# Altium project CrystalTaming.PrjPcb
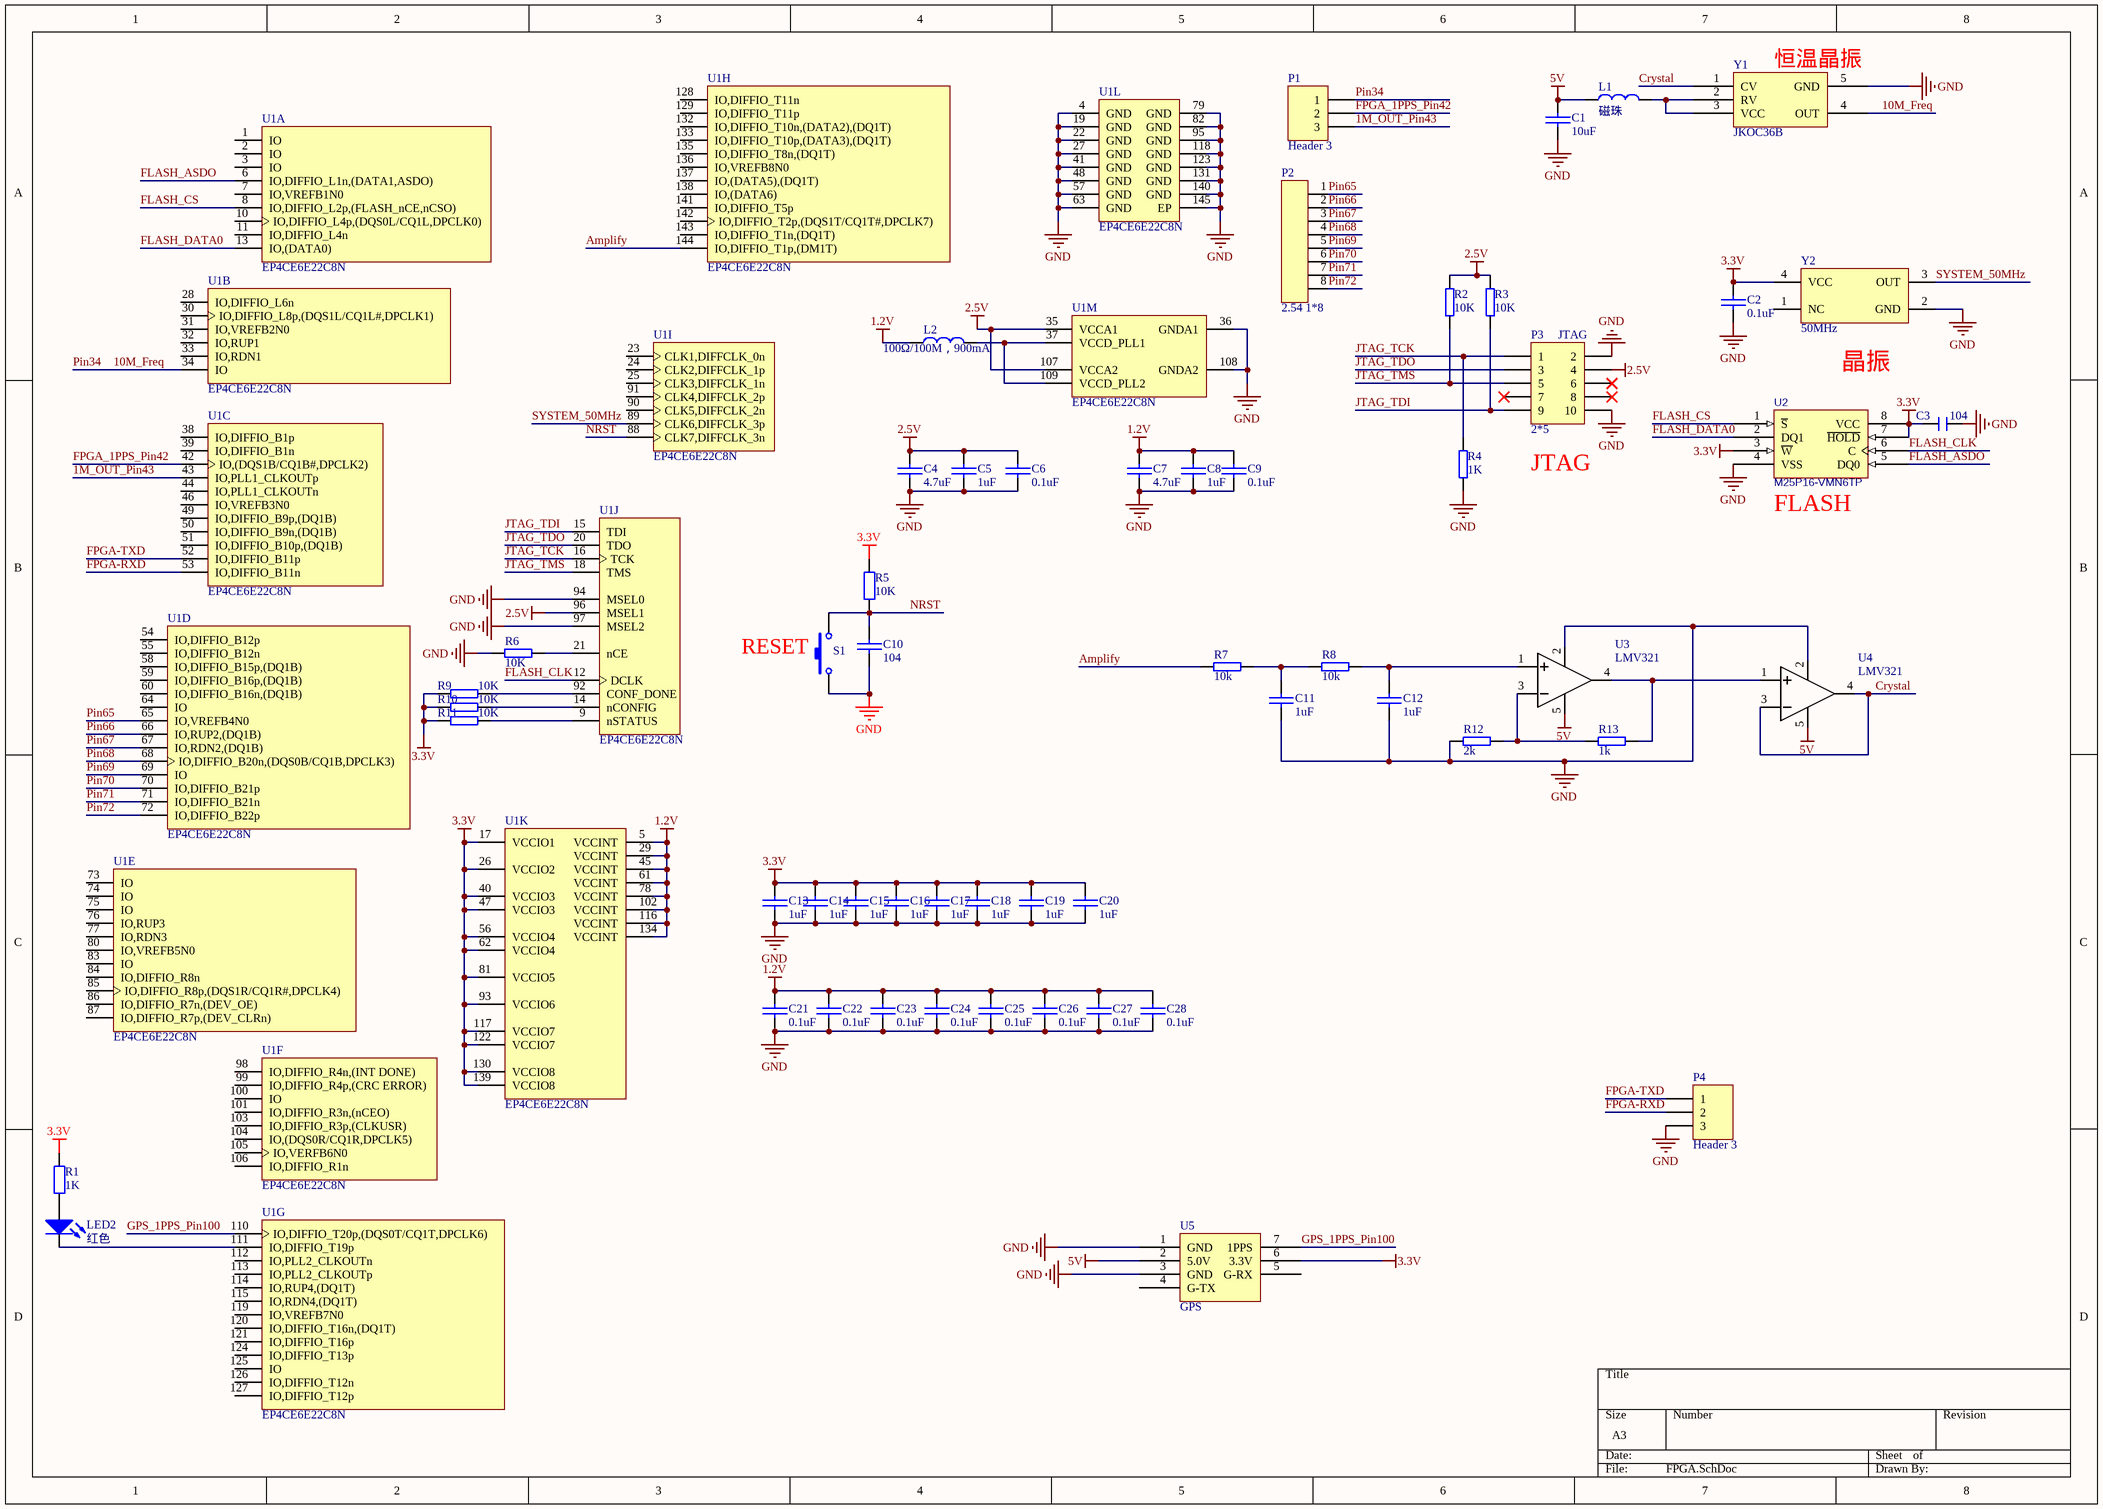
[diagram p0: FPGA.SchDoc]
4 sheets, 288 parts. Net scope: global (net labels, ports and power ports of the same name join across sheets).
Board files: GPSDO_V1.0.PcbDoc, GPSDO_V2.0.PcbDoc, GPSDO_V3.0.PcbDoc
Sheets:
  FPGA.SchDoc
  POWER.SchDoc
  GPSDO_V2.0.SchDoc
  GPSDO_V3.0.SchDoc

## Sheet FPGA.SchDoc
size A3; SheetNumber: 1; SheetTotal: 2

### Parts
(Parts that share a designator on the sheet are numbered #1, #2 ... from top to bottom, then left to right.)
C1#1  10uF  [0805]
C2#1  0.1uF  [0805]
C3#1  104  [0805]
C4#1  4.7uF  [0805]
C5#1  1uF  [0805]
C6#1  0.1uF  [0805]
C7#1  4.7uF  [0805]
C8#1  1uF  [0805]
C9#1  0.1uF  [0805]
C10#1  104  [0805]
C11#1  1uF  [0805]
C12#1  1uF  [0805]
C13#1  1uF  [0805]
C14#1  1uF  [0805]
C15#1  1uF  [0805]
C16  1uF  [0805]
C17  1uF  [0805]
C18#1  1uF  [0805]
C19#1  1uF  [0805]
C20#1  1uF  [0805]
C21#1  0.1uF  [0805]
C22#1  0.1uF  [0805]
C23#1  0.1uF  [0805]
C24#1  0.1uF  [0805]
C25#1  0.1uF  [0805]
C26#1  0.1uF  [0805]
C27#1  0.1uF  [0805]
C28#1  0.1uF  [0805]
L1#1  磁珠  [0805]
L2#1  100Ω/100M，900mA  [0805]
LED2#1  红色  [LED0805]
P1#1  Header 3  [HDR1X3]
P2#1  2.54 1*8  [单排插针 2.54 1*8]
P3#1  JTAG  封装: 2*5  [DC3压线座 2.54 2*5]
P4#1  Header 3  [HDR1X3]
R1#1  1K  [0805]
R2#1  10K  [0805]
R3#1  10K  [0805]
R4#1  1K  [0805]
R5#1  10K  [0805]
R6#1  10K  [0805]
R7#1  10k  [0805]
R8#1  10k  [0805]
R9#1  10K  [0805]
R10#1  10K  [0805]
R11#1  10K  [0805]
R12#1  2k  [0805]
R13#1  1k  [0805]
S1  key  [按键 轻触  6*3]  (value not drawn)
U1#1  EP4CE6E22C8N  [EP4CE6E22C8N]  (parts A,B,C,D,E,F,G,H,I,J,K,L,M of 13)
U2#1  M25P16-VMN6TP  [SOIC-8]
U3#1  LMV321  [SOT23-5]
U4#1  LMV321  [SOT23-5]
U5#1  GPS  [GPS]
Y1#1  JKOC36B  [恒温晶振 10M]
Y2#1  50MHz  [晶振 有源 5*7]

### Nets
1.2V: C7#1.2 C8#1.2 C9#1.2 C21#1.2 C22#1.2 C23#1.2 C24#1.2 C25#1.2 C26#1.2 C27#1.2 C28#1.2 L2#1.1 U1#1.5(VCCINT) U1#1.29(VCCINT) U1#1.45(VCCINT) U1#1.61(VCCINT) U1#1.78(VCCINT) U1#1.102(VCCINT) U1#1.116(VCCINT) U1#1.134(VCCINT)
2.5V: C4#1.2 C5#1.2 C6#1.2 P3#1.4 R2#1.1 R3#1.1 U1#1.35(VCCA1) U1#1.96(MSEL1) U1#1.107(VCCA2)
3.3V: C2#1.2 C3#1.2 C13#1.2 C14#1.2 C15#1.2 C16.2 C17.2 C18#1.2 C19#1.2 C20#1.2 R1#1.1 R5#1.1 R9#1.2 R10#1.2 R11#1.2 U1#1.17(VCCIO1) U1#1.26(VCCIO2) U1#1.40(VCCIO3) U1#1.47(VCCIO3) U1#1.56(VCCIO4) U1#1.62(VCCIO4) U1#1.81(VCCIO5) U1#1.93(VCCIO6) U1#1.117(VCCIO7) U1#1.122(VCCIO7) U1#1.130(VCCIO8) U1#1.139(VCCIO8) U2#1.3(~{W}) U2#1.7(~{HOLD}) U2#1.8(VCC) U5#1.6(3.3V) Y2#1.4(VCC)
5V: C1#1.1 L1#1.1 U3#1.5(VCC) U4#1.5(VCC) U5#1.2(5.0V)
GND: C1#1.2 C2#1.1 C3#1.1 C4#1.1 C5#1.1 C6#1.1 C7#1.1 C8#1.1 C9#1.1 C10#1.1 C11#1.1 C12#1.1 C13#1.1 C14#1.1 C15#1.1 C16.1 C17.1 C18#1.1 C19#1.1 C20#1.1 C21#1.1 C22#1.1 C23#1.1 C24#1.1 C25#1.1 C26#1.1 C27#1.1 C28#1.1 P3#1.2 P3#1.10 P4#1.3 R4#1.2 R6#1.2 R12#1.2 S1.1 U1#1.4(GND) U1#1.19(GND) U1#1.22(GND) U1#1.27(GND) U1#1.36(GNDA1) U1#1.41(GND) U1#1.48(GND) U1#1.57(GND) U1#1.63(GND) U1#1.79(GND) U1#1.82(GND) U1#1.94(MSEL0) U1#1.95(GND) U1#1.97(MSEL2) U1#1.108(GNDA2) U1#1.118(GND) U1#1.123(GND) U1#1.131(GND) U1#1.140(GND) U1#1.145(EP) U2#1.4(VSS) U3#1.2(GND) U4#1.2(GND) U5#1.1(GND) U5#1.3(GND) Y1#1.5(GND) Y2#1.2(GND)
1M_OUT_Pin43: P1#1.3 U1#1.43(IO,PLL1_CLKOUTp)
10M_Freq: P1#1.1 U1#1.34(IO) Y1#1.4(OUT)  [also labelled Pin34]
Amplify: R7#1.2 U1#1.144(IO,DIFFIO_T1p,(DM1T))
Crystal: U4#1.3(IN-) U4#1.4(OUT) Y1#1.1(CV)
FLASH_ASDO: U1#1.6(IO,DIFFIO_L1n,(DATA1,ASDO)) U2#1.5(DQ0)
FLASH_CLK: U1#1.12(DCLK) U2#1.6(C)
FLASH_CS: U1#1.8(IO,DIFFIO_L2p,(FLASH_nCE,nCSO)) U2#1.1(~{S})
FLASH_DATA0: U1#1.13(IO,(DATA0)) U2#1.2(DQ1)
FPGA-RXD: P4#1.2 U1#1.53(IO,DIFFIO_B11n)
FPGA-TXD: P4#1.1 U1#1.52(IO,DIFFIO_B11p)
FPGA_1PPS_Pin42: P1#1.2 U1#1.42(IO,(DQS1B/CQ1B#,DPCLK2))
GPS_1PPS_Pin100: U1#1.110(IO,DIFFIO_T20p,(DQS0T/CQ1T,DPCLK6)) U5#1.7(1PPS)
JTAG_TCK: P3#1.1 R4#1.1 U1#1.16(TCK)
JTAG_TDI: P3#1.9 R3#1.2 U1#1.15(TDI)
JTAG_TDO: P3#1.3 U1#1.20(TDO)
JTAG_TMS: P3#1.5 R2#1.2 U1#1.18(TMS)
NRST: C10#1.2 R5#1.2 S1.2 U1#1.88(CLK7,DIFFCLK_3n)
Pin65: P2#1.1 U1#1.65(IO,VREFB4N0)
Pin66: P2#1.2 U1#1.66(IO,RUP2,(DQ1B))
Pin67: P2#1.3 U1#1.67(IO,RDN2,(DQ1B))
Pin68: P2#1.4 U1#1.68(IO,DIFFIO_B20n,(DQS0B/CQ1B,DPCLK3))
Pin69: P2#1.5 U1#1.69(IO)
Pin70: P2#1.6 U1#1.70(IO,DIFFIO_B21p)
Pin71: P2#1.7 U1#1.71(IO,DIFFIO_B21n)
Pin72: P2#1.8 U1#1.72(IO,DIFFIO_B22p)
SYSTEM_50MHz: U1#1.89(CLK6,DIFFCLK_3p) Y2#1.3(OUT)
NetC11#1_2: C11#1.2 R7#1.1 R8#1.2
NetC12#1_2: C12#1.2 R8#1.1 U3#1.1(IN+)
NetL1#1_2: L1#1.2 Y1#1.2(RV) Y1#1.3(VCC)
NetL2#1_2: L2#1.2 U1#1.37(VCCD_PLL1) U1#1.109(VCCD_PLL2)
NetLED2#1_1: LED2#1.1(A) R1#1.2
NetLED2#1_2: LED2#1.2(K) U1#1.111(IO,DIFFIO_T19p)
NetR6#1_1: R6#1.1 U1#1.21(nCE)
NetR9#1_1: R9#1.1 U1#1.92(CONF_DONE)
NetR10#1_1: R10#1.1 U1#1.14(nCONFIG)
NetR11#1_1: R11#1.1 U1#1.9(nSTATUS)
NetR12#1_1: R12#1.1 R13#1.2 U3#1.3(IN-)
NetR13#1_1: R13#1.1 U3#1.4(OUT) U4#1.1(IN+)

Not connected (* = marked no-connect by the designer): P3#1 6* 7* 8*; U1#1 1(IO) 2(IO) 3(IO) 7(IO,VREFB1N0) 10(IO,DIFFIO_L4p,(DQS0L/CQ1L,DPCLK0)) 11(IO,DIFFIO_L4n) 23(CLK1,DIFFCLK_0n) 24(CLK2,DIFFCLK_1p) 25(CLK3,DIFFCLK_1n) 28(IO,DIFFIO_L6n) 30(IO,DIFFIO_L8p,(DQS1L/CQ1L#,DPCLK1)) 31(IO,VREFB2N0) 32(IO,RUP1) 33(IO,RDN1) 38(IO,DIFFIO_B1p) 39(IO,DIFFIO_B1n) 44(IO,PLL1_CLKOUTn) 46(IO,VREFB3N0) 49(IO,DIFFIO_B9p,(DQ1B)) 50(IO,DIFFIO_B9n,(DQ1B)) 51(IO,DIFFIO_B10p,(DQ1B)) 54(IO,DIFFIO_B12p) 55(IO,DIFFIO_B12n) 58(IO,DIFFIO_B15p,(DQ1B)) 59(IO,DIFFIO_B16p,(DQ1B)) 60(IO,DIFFIO_B16n,(DQ1B)) 64(IO) 73(IO) 74(IO) 75(IO) 76(IO,RUP3) 77(IO,RDN3) 80(IO,VREFB5N0) 83(IO) 84(IO,DIFFIO_R8n) 85(IO,DIFFIO_R8p,(DQS1R/CQ1R#,DPCLK4)) 86(IO,DIFFIO_R7n,(DEV_OE)) 87(IO,DIFFIO_R7p,(DEV_CLRn)) 90(CLK5,DIFFCLK_2n) 91(CLK4,DIFFCLK_2p) 98(IO,DIFFIO_R4n,(INT_DONE)) 99(IO,DIFFIO_R4p,(CRC_ERROR)) 100(IO) 101(IO,DIFFIO_R3n,(nCEO)) 103(IO,DIFFIO_R3p,(CLKUSR)) 104(IO,(DQS0R/CQ1R,DPCLK5)) 105(IO,VERFB6N0) 106(IO,DIFFIO_R1n) 112(IO,PLL2_CLKOUTn) 113(IO,PLL2_CLKOUTp) 114(IO,RUP4,(DQ1T)) 115(IO,RDN4,(DQ1T)) 119(IO,VREFB7N0) 120(IO,DIFFIO_T16n,(DQ1T)) 121(IO,DIFFIO_T16p) 124(IO,DIFFIO_T13p) 125(IO) 126(IO,DIFFIO_T12n) 127(IO,DIFFIO_T12p) 128(IO,DIFFIO_T11n) 129(IO,DIFFIO_T11p) 132(IO,DIFFIO_T10n,(DATA2),(DQ1T)) 133(IO,DIFFIO_T10p,(DATA3),(DQ1T)) 135(IO,DIFFIO_T8n,(DQ1T)) 136(IO,VREFB8N0) 137(IO,(DATA5),(DQ1T)) 138(IO,(DATA6)) 141(IO,DIFFIO_T5p) 142(IO,DIFFIO_T2p,(DQS1T/CQ1T#,DPCLK7)) 143(IO,DIFFIO_T1n,(DQ1T)); U5#1 4(G-TX) 5(G-RX); Y2#1 1(NC)

### Notes on the sheet
- (near Y1#1) 恒温晶振
- 晶振
- (near P3#1) JTAG
- (near U2#1) FLASH
- (near S1) RESET

### Library data of the parts
C1#1 C2#1 C4#1 C5#1 C6#1 C7#1 C8#1 C9#1 C11#1 C12#1 C13#1 C14#1 C15#1 C16 C17 C18#1 C19#1 C20#1 C21#1 C22#1 C23#1 C24#1 C25#1 C26#1 C27#1 C28#1 = 电容 贴片 0805: 名称: 贴片电容; 单位: 个; 封装: 0805
C3#1 = C: 无极性贴片电容; 版权归属: 源创客; 材质: X7R; BOM名称: 无极性贴片电容; 学习资源: www.ooocke.com
C10#1 = 贴片电容 0805: 名称: 贴片电容; 封装: 0603; 单位: 个
L1#1 L2#1 = 磁珠: 单位: 个; 名称: 磁珠; 封装: 0805
LED2#1 = 二极管 贴片发光 0805: 名称: 贴片发光二极管; 封装: 0805; 单位: 个
P1#1 P4#1 = Header 3: Header, 3-Pin; LatestRevisionDate: 17-Jul-2002; LatestRevisionNote: Re-released for DXP Platform.; Publisher: Altium Limited
P2#1 = 联结件 单排插针 2.54 1*8: 单位: 片; 封装: DIP; 名称: 单排插针
P3#1 = 联结件 DC3 2*5: 名称: 联结件; 单位: 个
R1#1 = 贴片电阻 0805: 名称: 贴片电阻; 单位: 个; 封装: 0805
R2#1 R3#1 R4#1 R6#1 R7#1 R8#1 R9#1 R10#1 R11#1 R12#1 R13#1 = 电阻 贴片 0805: 名称: 贴片电阻; 单位: 个; 封装: 0805
R5#1 = 贴片电阻 0603: 名称: 贴片电阻; 封装: 0603; 单位: 个
S1 = 按键 轻触 3*6: 单位: 个; 名称: 开关; 封装: 直插 12*12*12
U1#1 = 贴片芯片 EP4CE6E22C8N
U2#1 = M25P16-VMN6TP: BOM_Manufacturer: micron(镁光); Contributor: LCSC; BOM_Supplier: LCSC; BOM_Manufacturer Part: M25P16-VMN6TP; BOM_Supplier Part: C151067; BOM_JLCPCB Part Class: Extended Part; spicePre: U; spiceSymbolName: M25P16-VMN6TP
U3#1 U4#1 = 贴片芯片 LMV321: 单位: 个; 名称: 芯片; 封装: SOT23-5
Y1#1 = 恒温晶振 10M
Y2#1 = 晶振 有源: 名称: 晶振; 封装: 贴片; 单位: 个

## Sheet POWER.SchDoc
size A4; SheetNumber: 2; SheetTotal: 2
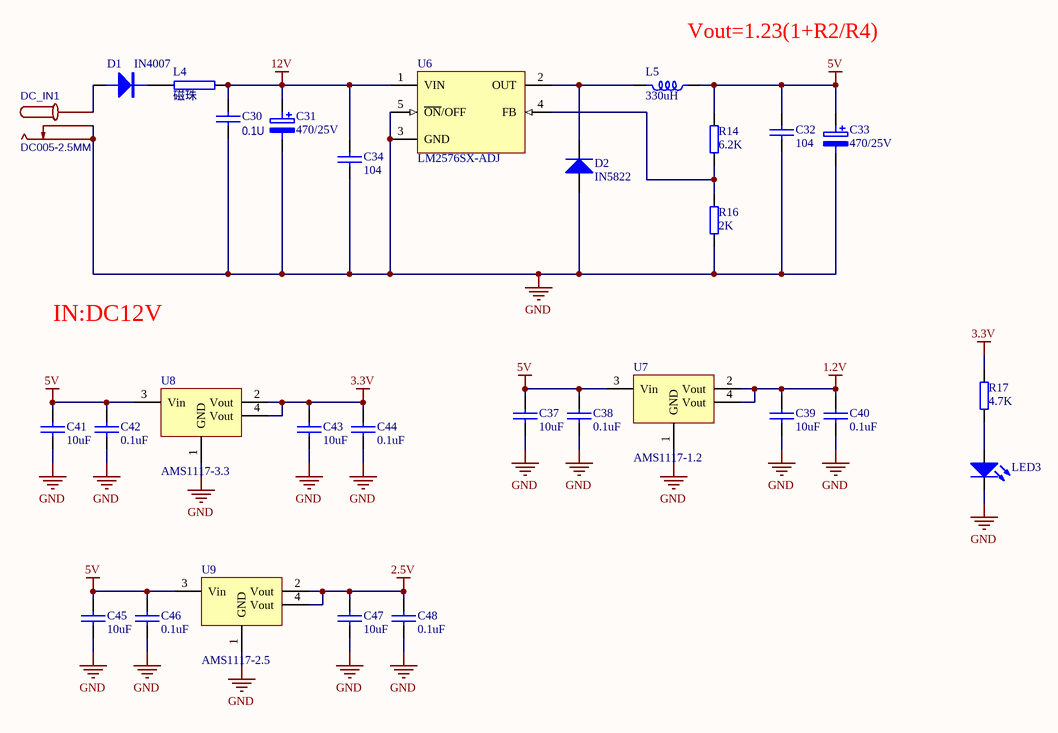
[diagram p1: POWER.SchDoc]

### Parts
(Parts that share a designator on the sheet are numbered #1, #2 ... from top to bottom, then left to right.)
C30#1  0.1U  [0805]
C31#1  470/25V  [电容 铝电解 470U/35V]
C32#1  104  [0805]
C33#1  470/25V  [电容 铝电解 470U/35V]
C34#1  104  [0805]
C37  10uF  [0805]
C38  0.1uF  [0805]
C39  10uF  [0805]
C40  0.1uF  [0805]
C41  10uF  [0805]
C42  0.1uF  [0805]
C43  10uF  [0805]
C44  0.1uF  [0805]
C45  10uF  [0805]
C46  0.1uF  [0805]
C47  10uF  [0805]
C48  0.1uF  [0805]
D1#1  IN4007  [二极管 贴片 4007]
D2#1  IN5822  [二极管 贴片 4007]
DC_IN1  DC005-2.5MM  [DC005-2.5MM]
L4  磁珠  [0805]
L5#1  330uH  [电感 贴片 12*12]
LED3#1  (no value)  [LED0805]
R14#1  6.2K  [0805]
R16#1  2K  [0805]
R17#1  4.7K  [0805]
U6#1  LM2576SX-ADJ  [TO263 LM2576]
U7#1  AMS1117-1.2  [SOT223]
U8#1  AMS1117-3.3  [SOT223]
U9#1  AMS1117-2.5  [SOT223]

### Nets
1.2V: C39.2 C40.2 U7#1.2(Vout) U7#1.4(Vout)
2.5V: C47.2 C48.2 U9#1.2(Vout) U9#1.4(Vout)
3.3V: C43.2 C44.2 R17#1.1 U8#1.2(Vout) U8#1.4(Vout)
5V: C32#1.2 C33#1.1 C37.2 C38.2 C41.2 C42.2 C45.2 C46.2 L5#1.2 R14#1.1 U7#1.3(Vin) U8#1.3(Vin) U9#1.3(Vin)
12V: C30#1.2 C31#1.1 C34#1.2 L4.1 U6#1.1(VIN)
GND: C30#1.1 C31#1.2 C32#1.1 C33#1.2 C34#1.1 C37.1 C38.1 C39.1 C40.1 C41.1 C42.1 C43.1 C44.1 C45.1 C46.1 C47.1 C48.1 D2#1.1(A) DC_IN1.2 DC_IN1.3 LED3#1.2(K) R16#1.2 U6#1.3(GND) U6#1.5(~{ON}/OFF) U7#1.1(GND) U8#1.1(GND) U9#1.1(GND)
NetD1#1_1: D1#1.1 DC_IN1.1
NetD1#1_2: D1#1.2 L4.2
NetD2#1_2: D2#1.2(K) L5#1.1 U6#1.2(OUT)
NetLED3#1_1: LED3#1.1(A) R17#1.2
NetR14#1_2: R14#1.2 R16#1.1 U6#1.4(FB)

### Notes on the sheet
- (near L5#1) Vout=1.23(1+R2/R4)
- IN:DC12V

### Library data of the parts
C30#1 = CAP
C31#1 C33#1 = 电容 贴片 铝电解 470u/25V: 名称: 贴片铝电解电容; 封装: 贴片; 单位: 个
C32#1 C34#1 C37-C48 = 电容 贴片 0805: 名称: 贴片电容; 单位: 个; 封装: 0805
D1#1 = DIODE
D2#1 = 二极管 贴片4007: 名称: 贴片二极管; 封装: 贴片; 单位: 个
DC_IN1 = DC005-2.5MM: BOM_Manufacturer: SOFNG(硕方); BOM_Manufacturer Part: DC005-T25; BOM_Supplier: LCSC; BOM_Supplier Part: C111573; BOM_JLCPCB Part Class: Extended Part; spicePre: D; spiceSymbolName: DC005-2.5MM
L4 = RES2
L5#1 = 电感 贴片 0805: 名称: 贴片电感; 封装: 0805; 单位: 个
LED3#1 = 二极管 贴片发光 0805: 名称: 贴片发光二极管; 封装: 0805; 单位: 个
R14#1 R16#1 R17#1 = 电阻 贴片 0805: 名称: 贴片电阻; 单位: 个; 封装: 0805
U6#1 = LM2576SX-5.0: DC-DC芯片; ComponentLink1Description: 供应商链接; ComponentLink1URL: http://www.szlcsc.com/product/details_35434.html; Package: TO-263-5; Supplier: LC; SuppliersPartNumber: C34465
U7#1 U8#1 U9#1 = 贴片芯片 SPX1117M3-3.3: LDO; 名称: 贴片芯片; 单位: 个; 封装: SOT223

## Sheet GPSDO_V2.0.SchDoc
size 457 x 330 mm
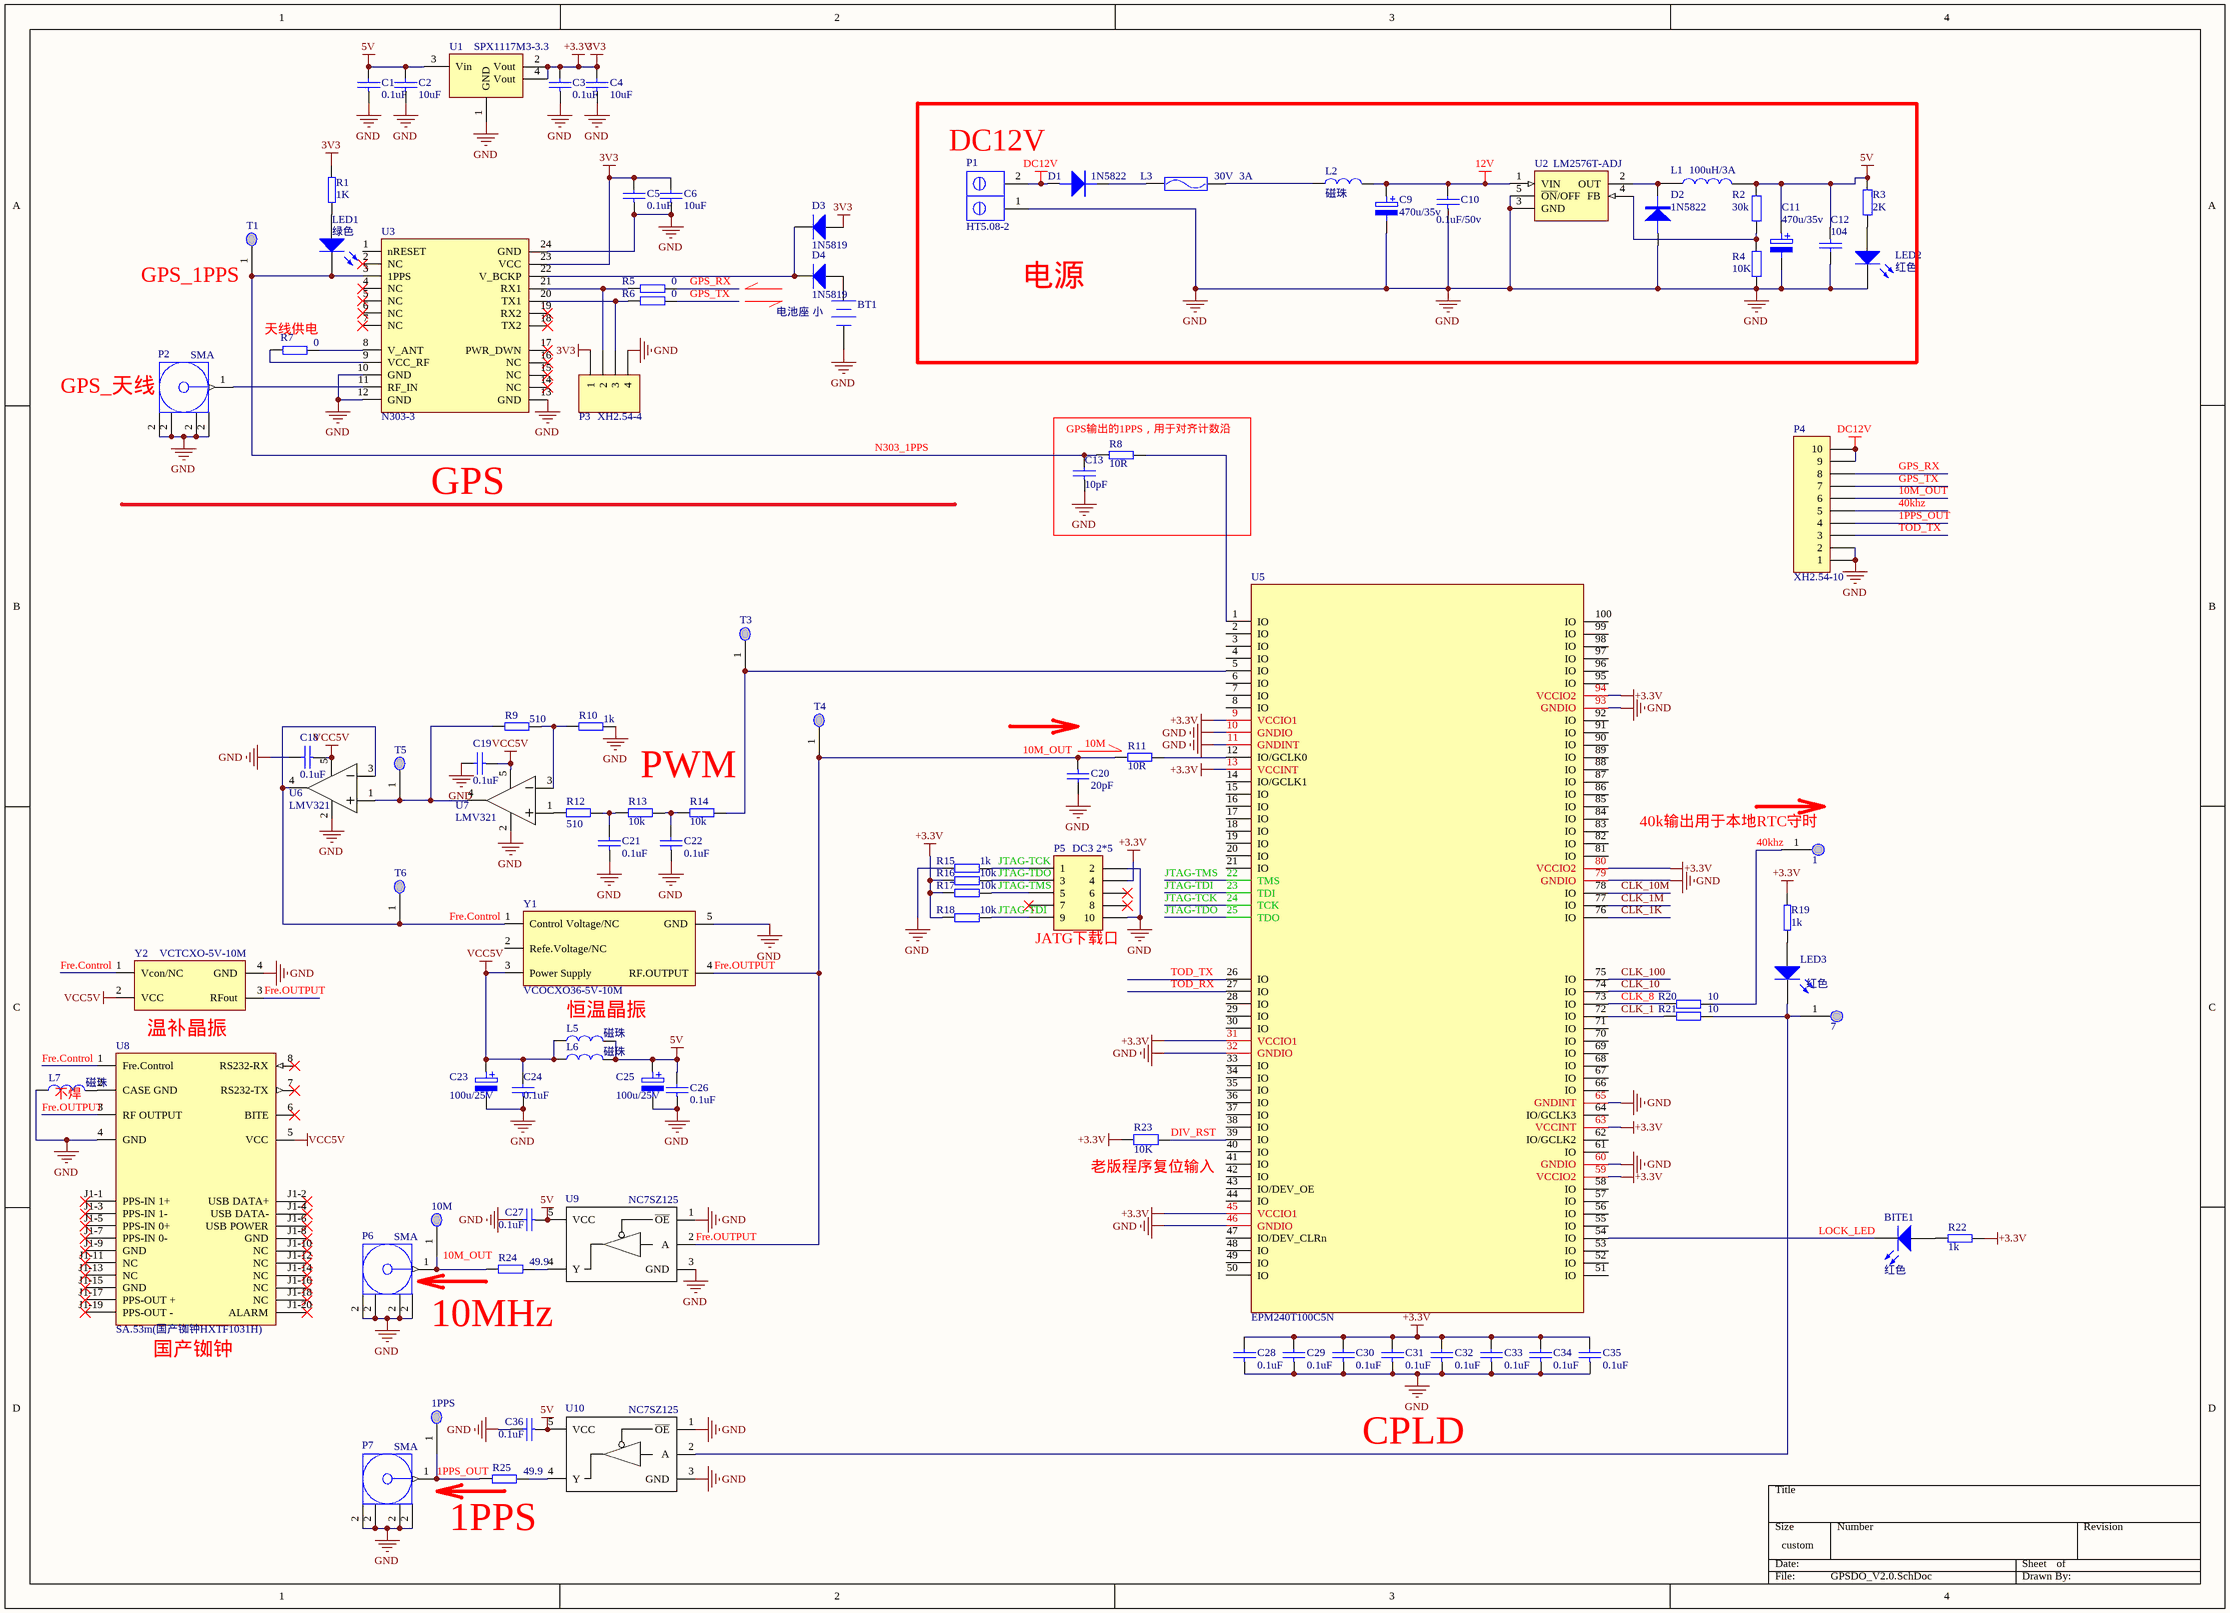
[diagram p2: GPSDO_V2.0.SchDoc]

### Parts
(Parts that share a designator on the sheet are numbered #1, #2 ... from top to bottom, then left to right.)
1#1  TEST  [测试点（圆形）]  (value not drawn)
1PPS#1  TEST  [测试点（圆形）]  (value not drawn)
7#1  TEST  [测试点（圆形）]  (value not drawn)
10M#1  TEST  [测试点（圆形）]  (value not drawn)
BITE1#1  红色  [LED0805]
BT1#1  电池座 小  [电池座 2032  直插]
C1#2  0.1uF  [0805]
C2#2  10uF  [1206]
C3#2  0.1uF  [0805]
C4#2  10uF  [1206]
C5#2  0.1uF  [0805]
C6#2  10uF  [1206]
C9#2  470u/35v  [电容 铝电解 470U/35V]
C10#2  0.1uF/50v  [0805]
C11#2  470u/35v  [电容 铝电解 470U/35V]
C12#2  104  [0805]
C13#2  10pF  [0805]
C18#2  0.1uF  [0805]
C19#2  0.1uF  [0805]
C20#2  20pF  [0805]
C21#2  0.1uF  [0805]
C22#2  0.1uF  [0805]
C23#2  100u/25V  [1206]
C24#2  0.1uF  [0805]
C25#2  100u/25V  [1206]
C26#2  0.1uF  [0805]
C27#2  0.1uF  [0805]
C28#2  0.1uF  [0805]
C29#1  0.1uF  [0805]
C30#2  0.1uF  [0805]
C31#2  0.1uF  [0805]
C32#2  0.1uF  [0805]
C33#2  0.1uF  [0805]
C34#2  0.1uF  [0805]
C35#1  0.1uF  [0805]
C36#1  0.1uF  [0805]
D1#2  1N5822  [二极管 贴片 4007]
D2#2  1N5822  [二极管 贴片 4007]
D3#1  1N5819  [二极管 贴片 IN4148]
D4#1  1N5819  [二极管 贴片 IN4148]
L1#2  100uH/3A  [电感 贴片 12*12]
L2#2  磁珠  [磁珠 直插]
L3#1  30V  3A  [30V/4A 自恢复保险]
L5#2  磁珠  [0805]
L6#1  磁珠  [0805]
L7#1  磁珠  [0805]
LED1#1  绿色  [LED0805]
LED2#2  红色  [Led0805]
LED3#2  红色  [LED0805]
P1#2  HT5.08-2  [KF128L-5.08-2P]
P2#2  SMA  [天线座 50ohm 直立]
P3#2  XH2.54-4  [VH2.54_4]
P4#2  XH2.54-10  [VH2.54_10]
P5#1  封装: DC3 2*5  [双排插针 2.54 2*5]  (hidden comment: DC3压线座)
P6#1  SMA  [天线座 50ohm 直立]
P7#1  SMA  [天线座 50ohm 直立]
R1#2  1K  [0805]
R2#2  30k  [0805]
R3#2  2K  [0805]
R4#2  10K  [0805]
R5#2  0  [0805]
R6#2  0  [0805]
R7#2  0  [0805]
R8#2  10R  [0805]
R9#2  510  [0805]
R10#2  1k  [0805]
R11#2  10R  [0805]
R12#2  510  [0805]
R13#2  10k  [0805]
R14#2  10k  [0805]
R15#1  1k  [0805]
R16#2  10k  [0805]
R17#2  10k  [0805]
R18#1  10k  [0805]
R19#1  1k  [0805]
R20#1  10  [0805]
R21#1  10  [0805]
R22#1  1k  [0805]
R23#1  10K  [0805]
R24#1  49.9  [0805]
R25#1  49.9  [0805]
T1#1  TEST  [测试点（圆形）]  (value not drawn)
T3#1  TEST  [测试点（圆形）]  (value not drawn)
T4#1  TEST  [测试点（圆形）]  (value not drawn)
T5#1  TEST  [测试点（圆形）]  (value not drawn)
T6#1  TEST  [测试点（圆形）]  (value not drawn)
U1#2  SPX1117M3-3.3  [SOT223]
U2#2  LM2576T-ADJ  [TO220 LM2576-YA30]
U3#2  N303-3  [模块 N303-3]
U5#2  EPM240T100C5N  [TQFP100]
U6#2  LMV321  [SOT23-5]
U7#2  LMV321  [SOT23-5]
U8#2  SA.53m(国产铷钟HXTF1031H)  [模块 SA.53m]
U9#2  NC7SZ125  [SOT23-5]
U10#1  NC7SZ125  [SOT23-5]
Y1#2  VCOCXO36-5V-10M  [模块 VCOCXO36-12V-10M]
Y2#2  VCTCXO-5V-10M  [模块 VCTCXO-5V-10M]

### Blocks framed on the sheet
GPS输出的1PPS，用于对齐计数沿: C13#2 R8#2

### Nets
5V: C1#2.2 C2#2.2 C11#2.1 C12#2.1 C25#2.1 C26#2.2 C27#2.1 C36#1.1 L1#2.2 L5#2.2 L6#1.2 R2#2.2 R3#2.1 U1#2.3(Vin) U9#2.5(VCC) U10#1.5(VCC)
12V: C9#2.1 C10#2.2 L2#2.2 U2#2.1(VIN)
+3.3V: C3#2.2 C4#2.2 C5#2.2 C6#2.2 C28#2.2 C29#1.2 C30#2.2 C31#2.2 C32#2.2 C33#2.2 C34#2.2 C35#1.2 D3#1.1(A) P3#2.1 P5#1.4 R1#2.1 R16#2.2 R17#2.2 R18#1.2 R19#1.1 R22#1.2 R23#1.2 U1#2.2(Vout) U1#2.4(Vout) U3#2.23(VCC) U5#2.9(VCCIO1) U5#2.13(VCCINT) U5#2.31(VCCIO1) U5#2.45(VCCIO1) U5#2.59(VCCIO2) U5#2.63(VCCINT) U5#2.80(VCCIO2) U5#2.94(VCCIO2)  [also labelled 3V3]
DC12V: D1#2.1(A) P1#2.2 P4#2.9 P4#2.10
GND: BT1#1.2(-) C1#2.1 C2#2.1 C3#2.1 C4#2.1 C5#2.1 C6#2.1 C9#2.2 C10#2.1 C11#2.2 C12#2.2 C13#2.1 C18#2.2 C19#2.2 C20#2.2 C21#2.1 C22#2.1 C23#2.2 C24#2.1 C25#2.2 C26#2.1 C27#2.2 C28#2.1 C29#1.1 C30#2.1 C31#2.1 C32#2.1 C33#2.1 C34#2.1 C35#1.1 C36#1.2 D2#2.1(A) L7#1.1 LED2#2.2(K) P1#2.1 P2#2.2 P3#2.4 P4#2.1 P4#2.2 P5#1.2 P5#1.10 P6#1.2 P7#1.2 R4#2.1 R10#2.1 R15#1.1 U1#2.1(GND) U2#2.3(GND) U2#2.5(~{ON}/OFF) U3#2.10(GND) U3#2.12(GND) U3#2.13(GND) U3#2.24(GND) U5#2.10(GNDIO) U5#2.11(GNDINT) U5#2.32(GNDIO) U5#2.46(GNDIO) U5#2.60(GNDIO) U5#2.65(GNDINT) U5#2.79(GNDIO) U5#2.93(GNDIO) U6#2.2(GND) U7#2.2(GND) U8#2.4(GND) U9#2.1(~{OE}) U9#2.3(GND) U10#1.1(~{OE}) U10#1.3(GND) Y1#2.5(GND) Y2#2.4(GND)
VCC5V: C18#2.1 C19#2.1 C23#2.1 C24#2.2 L5#2.1 L6#1.1 U6#2.5(VCC) U7#2.5(VCC) U8#2.5(VCC) Y1#2.3(Power_Supply) Y2#2.2(VCC)
1PPS_OUT: 1PPS#1.1 P4#2.4 P7#1.1(Signal) R25#1.2
10M_OUT: C20#2.1 P4#2.6 R11#2.2 T4#1.1 U8#2.3(RF_OUTPUT) U9#2.2(A) Y1#2.4(RF.OUTPUT) Y2#2.3(RFout)  [also labelled Fre.OUTPUT]
40khz: 1#1.1 P4#2.5 R20#1.1
CLK_1: R21#1.2 U5#2.72(IO)
CLK_1K: U5#2.76(IO)
CLK_1M: U5#2.77(IO)
CLK_8: R20#1.2 U5#2.73(IO)
CLK_10: U5#2.74(IO)
CLK_10M: U5#2.78(IO)
CLK_100: U5#2.75(IO)
DIV_RST: R23#1.1 U5#2.39(IO)
Fre.Control: T6#1.1 U6#2.3(IN-) U6#2.4(OUT) U8#2.1(Fre.Control) Y1#2.1(Control_Voltage/NC) Y2#2.1(Vcon/NC)
GPS_RX: P4#2.8 R5#2.1
GPS_TX: P4#2.7 R6#2.1
JTAG-TCK: P5#1.1 R15#1.2 U5#2.24(TCK)
JTAG-TDI: P5#1.9 R18#1.1 U5#2.23(TDI)
JTAG-TDO: P5#1.3 R16#2.1 U5#2.25(TDO)
JTAG-TMS: P5#1.5 R17#2.1 U5#2.22(TMS)
LOCK_LED: BITE1#1.2(K) U5#2.54(IO)
N303_1PPS: C13#2.2 LED1#1.2(K) R8#2.2 T1#1.1 U3#2.3(1PPS)
TOD_RX: U5#2.27(IO)
TOD_TX: P4#2.3 U5#2.26(IO)
Net7#1_1: 7#1.1 LED3#2.2(K) R21#1.1 U10#1.2(A)
Net10M#1_1: 10M#1.1 P6#1.1(Signal) R24#1.2
NetBITE1#1_1: BITE1#1.1(A) R22#1.1
NetBT1#1_1: BT1#1.1(+) D4#1.1(A)
NetC21#2_2: C21#2.2 R12#2.1 R13#2.2
NetC22#2_2: C22#2.2 R13#2.1 R14#2.2
NetD1#2_2: D1#2.2(K) L3#1.1
NetD2#2_2: D2#2.2(K) L1#2.1 U2#2.2(OUT)
NetD3#1_2: D3#1.2(K) D4#1.2(K) U3#2.22(V_BCKP)
NetL2#2_1: L2#2.1 L3#1.2
NetL7#1_2: L7#1.2 U8#2.2(CASE_GND)
NetLED1#1_1: LED1#1.1(A) R1#2.2
NetLED2#2_1: LED2#2.1(A) R3#2.2
NetLED3#2_1: LED3#2.1(A) R19#1.2
NetP2#2_1: P2#2.1(Signal) U3#2.11(RF_IN)
NetP3#2_2: P3#2.2 R5#2.2 U3#2.21(RX1)
NetP3#2_3: P3#2.3 R6#2.2 U3#2.20(TX1)
NetR2#2_1: R2#2.1 R4#2.2 U2#2.4(FB)
NetR7#2_1: R7#2.1 U3#2.8(V_ANT)
NetR7#2_2: R7#2.2 U3#2.9(VCC_RF)
NetR8#2_1: R8#2.1 U5#2.1(IO)
NetR9#2_1: R9#2.1 R10#2.2 U7#2.3(IN-)
NetR9#2_2: R9#2.2 T5#1.1 U6#2.1(IN+) U7#2.4(OUT)
NetR11#2_1: R11#2.1 U5#2.12(IO/GCLK0)
NetR12#2_2: R12#2.2 U7#2.1(IN+)
NetR14#2_1: R14#2.1 T3#1.1 U5#2.5(IO)
NetR24#1_1: R24#1.1 U9#2.4(Y)
NetR25#1_1: R25#1.1 U10#1.4(Y)

Not connected (* = marked no-connect by the designer): P5#1 6* 7* 8*; U3#2 1(nRESET) 2(NC)* 4(NC)* 5(NC)* 6(NC)* 7(NC)* 14(NC)* 15(NC)* 16(NC)* 17(PWR_DWN)* 18(TX2)* 19(RX2)*; U5#2 2(IO) 3(IO) 4(IO) 6(IO) 7(IO) 8(IO) 14(IO/GCLK1) 15(IO) 16(IO) 17(IO) 18(IO) 19(IO) 20(IO) 21(IO) 28(IO) 29(IO) 30(IO) 33(IO) 34(IO) 35(IO) 36(IO) 37(IO) 38(IO) 40(IO) 41(IO) 42(IO) 43(IO/DEV_OE) 44(IO) 47(IO/DEV_CLRn) 48(IO) 49(IO) 50(IO) 51(IO) 52(IO) 53(IO) 55(IO) 56(IO) 57(IO) 58(IO) 61(IO) 62(IO/GCLK2) 64(IO/GCLK3) 66(IO) 67(IO) 68(IO) 69(IO) 70(IO) 71(IO) 81(IO) 82(IO) 83(IO) 84(IO) 85(IO) 86(IO) 87(IO) 88(IO) 89(IO) 90(IO) 91(IO) 92(IO) 95(IO) 96(IO) 97(IO) 98(IO) 99(IO) 100(IO); U8#2 6(BITE)* 7(RS232-TX)* 8(RS232-RX)* J1-1(PPS-IN_1+)* J1-2(USB_DATA+)* J1-3(PPS-IN_1-)* J1-4(USB_DATA-)* J1-5(PPS-IN_0+)* J1-6(USB_POWER)* J1-7(PPS-IN_0-)* J1-8(GND)* J1-9(GND)* J1-10(NC)* J1-11(NC)* J1-12(NC)* J1-13(NC)* J1-14(NC)* J1-15(GND)* J1-16(NC)* J1-17(PPS-OUT_+)* J1-18(NC)* J1-19(PPS-OUT_-)* J1-20(ALARM)*; Y1#2 2(Refe.Voltage/NC)

### Notes on the sheet
- (near P1#2) DC12V
- (near T1#1) GPS_1PPS
- (near R7#2) 天线供电
- 电源
- (near P2#2) GPS_天线
- GPS
- 10M
- PWM
- 40k输出用于本地RTC守时
- (near P5#1) JATG下载口
- 恒温晶振
- 温补晶振
- (near L7#1) 不焊
- (near R23#1) 老版程序复位输入
- (near U8#2) 国产铷钟
- 10MHz
- CPLD
- (near R25#1) 1PPS
- Labels drawn without touching a wire or pin: 10M_OUT

### Library data of the parts
1#1 1PPS#1 7#1 10M#1 T1#1 T3#1 T4#1 T5#1 T6#1 = 测试点_小: 单位: 个; 名称: 测试点; 封装: 直插
BITE1#1 LED1#1 LED2#2 LED3#2 = 贴片发光二极管 0805: 封装: 0805; 单位: 个; 名称: 贴片发光二极管
C1#2 C3#2 C5#2 C10#2 C13#2 C18#2 C19#2 C20#2 C21#2 C22#2 C24#2 C26#2 C27#2 C28#2 C29#1 C30#2 C31#2 C32#2 C33#2 C34#2 C35#1 C36#1 = 电容 贴片 0805: 名称: 贴片电容; 单位: 个; 封装: 0805
C2#2 C4#2 C6#2 = 电容 贴片 0805: 名称: 贴片电容; 封装: 0805; 单位: 个
C9#2 = 电容 直插 电解  470u/35v: 名称: 电解电容; 封装: 直插; 单位: 个
C11#2 = 电解电容 470u/35v: 名称: 电解电容; 封装: 贴片; 单位: 个
C12#2 = 贴片电容 0805: 名称: 贴片电容; 单位: 个; 封装: 0805
C23#2 C25#2 = 电容 贴片 铝电解 470u/25V: 名称: 贴片铝电解电容; 封装: 贴片; 单位: 个
D1#2 D2#2 = 二极管 1N5822: 名称: 二极管; 封装: 直插; 单位: 个
D3#1 D4#1 = 二极管 贴片 1N4148: 名称: 贴片二极管; 封装: 贴片; 单位: 个
L1#2 = 电感 330uH/3A: 名称: 电感; 封装: 分立; 单位: 个
L2#2 = 磁珠: 封装: 0805; 单位: 个; 名称: 磁珠
L3#1 = 保险 自恢复: 单位: 个; 封装: 0805; 名称: 自恢复保险管
L5#2 L6#1 L7#1 = 磁珠: 单位: 个; 名称: 磁珠; 封装: 0805
P1#2 = 连接件 HT5.08-2: 名称: 连接件; 单位: 套; 封装: HT5.08-2
P2#2 P6#1 P7#1 = 连接件 天线座 SMA: 单位: 个; 封装: 直插; 名称: 联接件
P3#2 = 联结件 XH2.54-4: 名称: 联结件; 单位: 套; 封装: XH2.54-4
P4#2 = 连接件 XH2.54-10: 名称: 连接件; 单位: 套; 封装: XH2.54-10
P5#1 = 联结件 DC3 2*5: 名称: 联结件; 单位: 个
R1#2 R5#2 R6#2 R7#2 R8#2 R9#2 R10#2 R11#2 R12#2 R13#2 R14#2 R15#1 R16#2 R17#2 R18#1 R19#1 R20#1 R21#1 R22#1 R24#1 R25#1 = 电阻 贴片 0805: 名称: 贴片电阻; 单位: 个; 封装: 0805
R2#2 R3#2 R4#2 R23#1 = 贴片电阻 0805: 名称: 贴片电阻; 单位: 个; 封装: 0805
U1#2 = 贴片芯片 SPX1117M3-3.3: LDO; 名称: 贴片芯片; 单位: 个; 封装: SOT223
U2#2 = 贴片芯片 LM2575T-ADJ: 名称: 芯片; 封装: 直插; 单位: 个
U3#2 = 模块 N303-3: 单位: 个; 名称: 模块; 封装: 贴片
U6#2 U7#2 = 贴片芯片 LMV321: 单位: 个; 名称: 芯片; 封装: SOT23-5
U8#2 = 模块 SA.53m: 封装: 直插; 单位: 个; 名称: 晶振
U9#2 U10#1 = 贴片芯片 NC7SZ125: 超高速缓冲; 单位: 个; 名称: 芯片; 封装: SOT23-5
Y1#2 = 模块 恒温VCOCXO36-12V 10M: 封装: 直插; 名称: 晶振; 单位: 个
Y2#2 = 模块 VCTCXO-5V-10M: 名称: 晶振; 单位: 个; 封装: 直插
BT1#1 = 电池座 小: Published: 24-Mar-1999; LatestRevisionDate: 17-Jul-2002; LatestRevisionNote: Re-released for DXP Platform.; PackageReference: BAT-2; Publisher: Altium Limited

## Sheet GPSDO_V3.0.SchDoc
size 711 x 381 mm
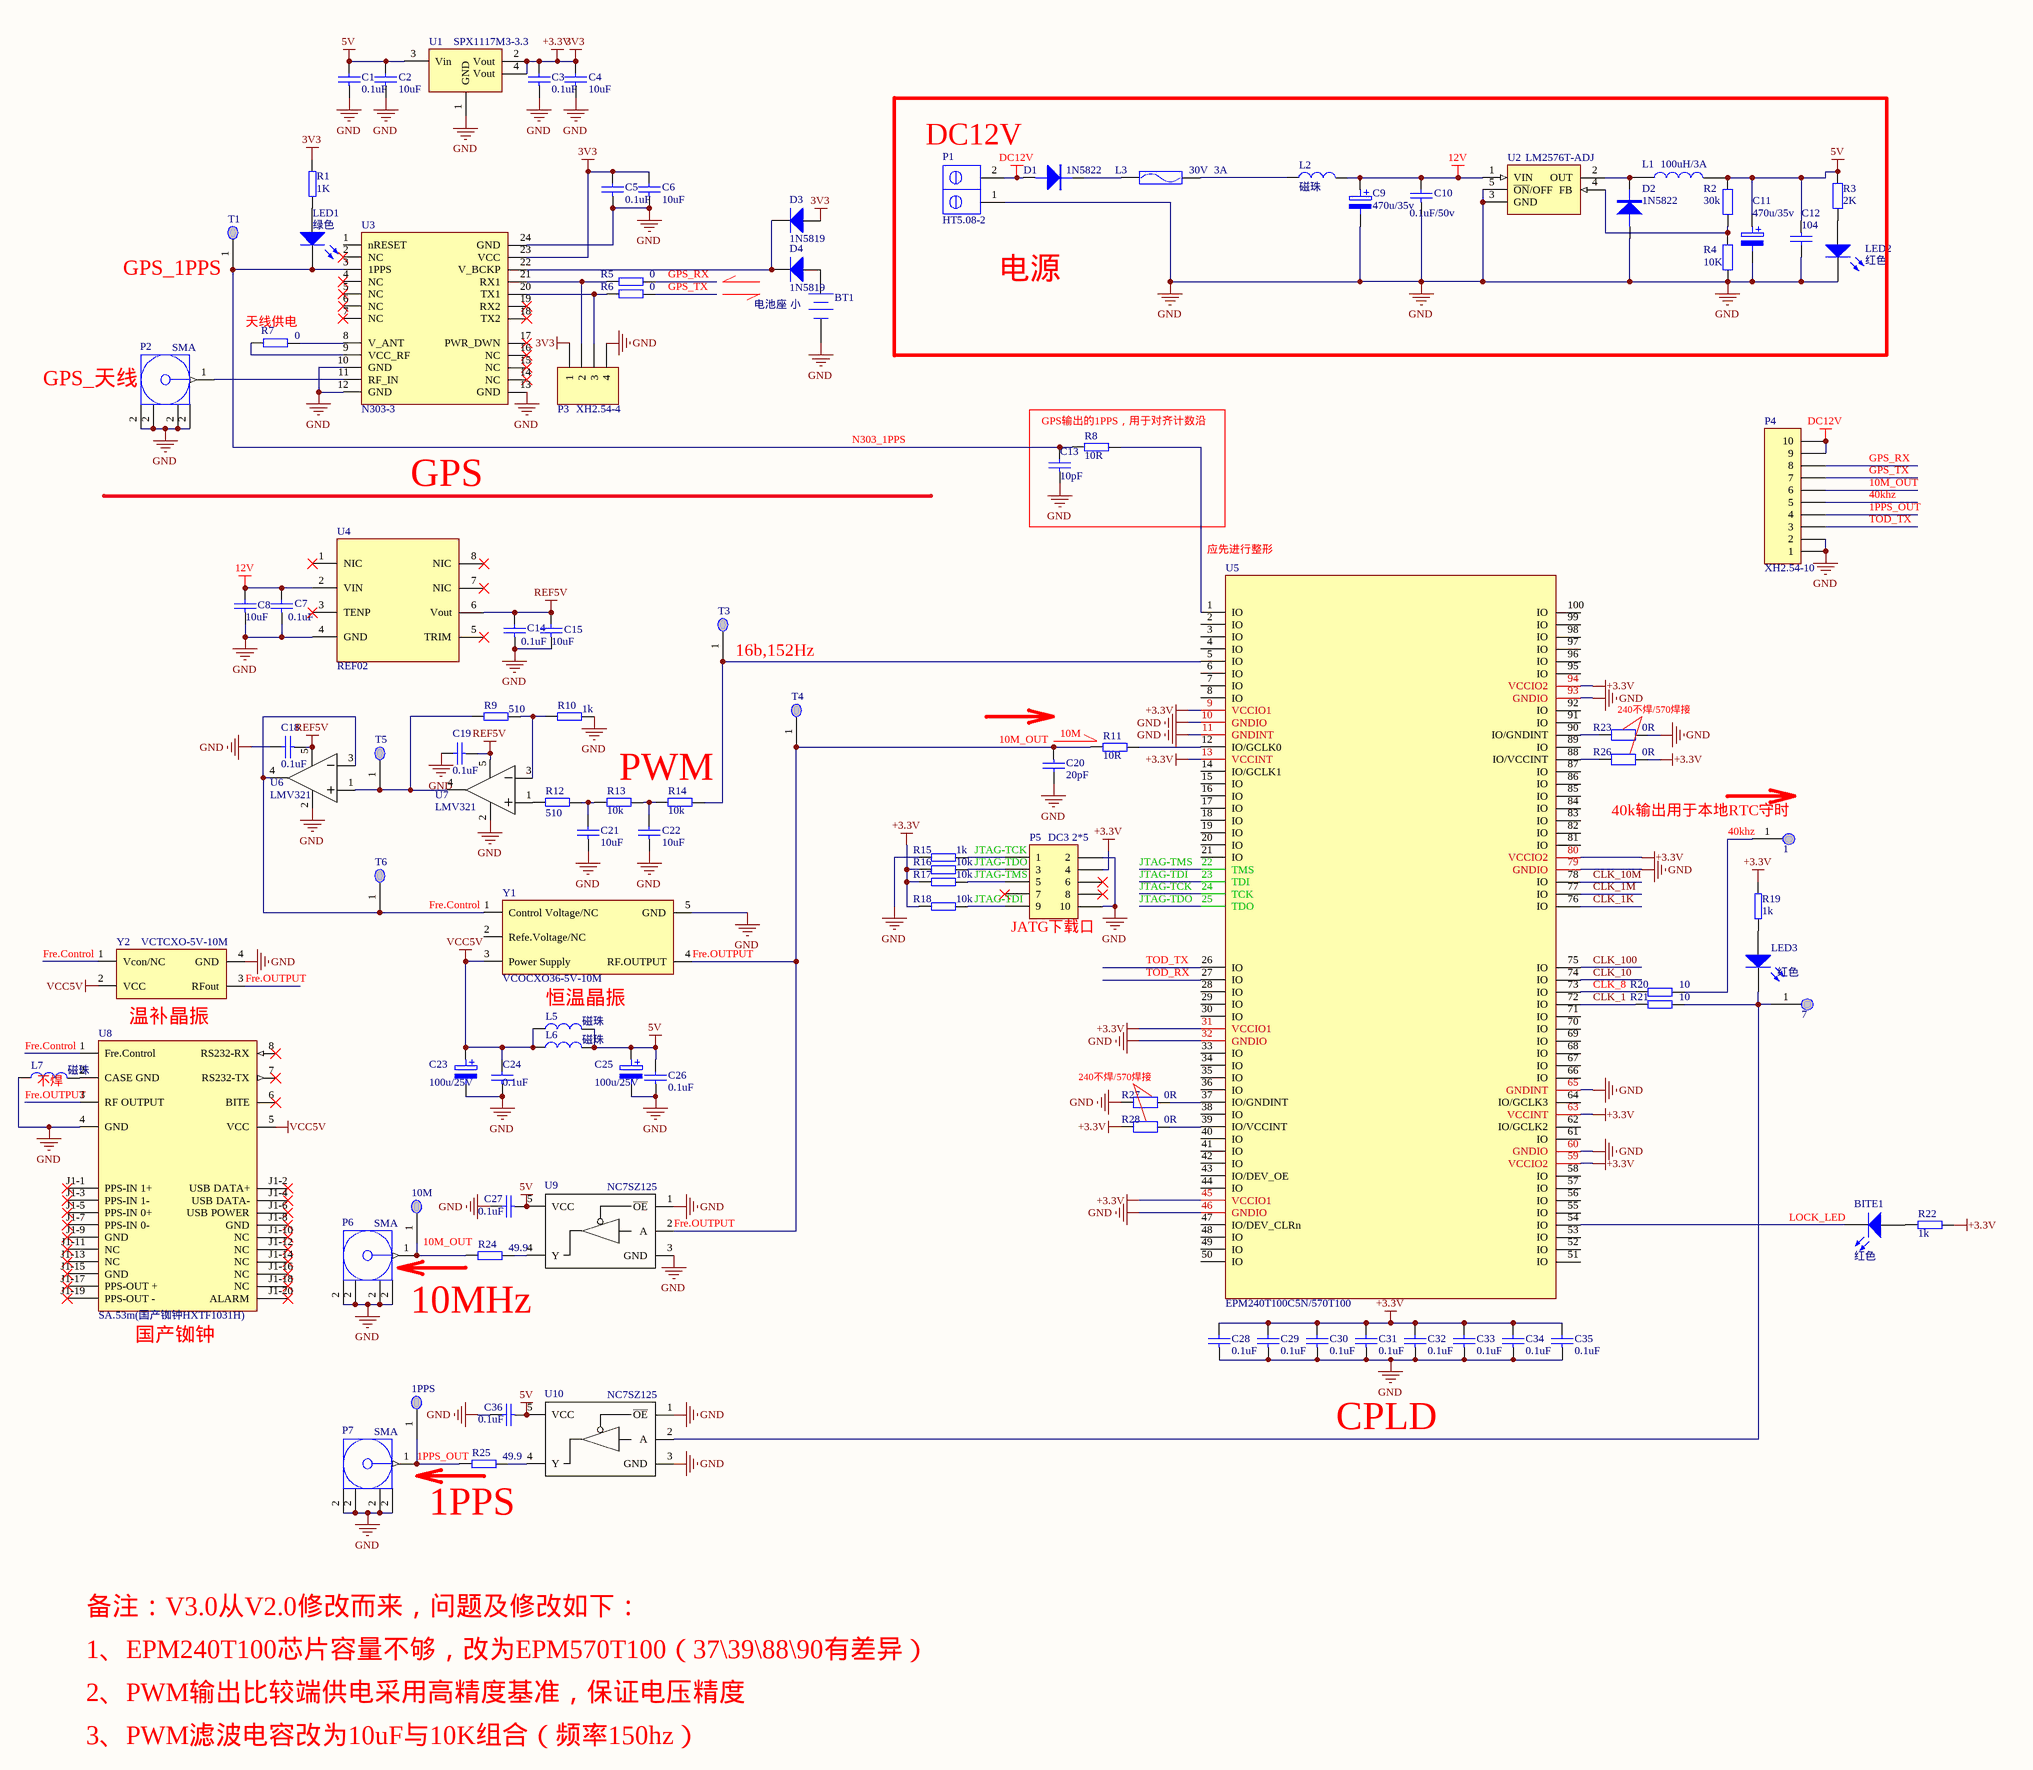
[diagram p3: GPSDO_V3.0.SchDoc]

### Parts
(Parts that share a designator on the sheet are numbered #1, #2 ... from top to bottom, then left to right.)
1#2  TEST  [测试点（圆形）]  (value not drawn)
1PPS#2  TEST  [测试点（圆形）]  (value not drawn)
7#2  TEST  [测试点（圆形）]  (value not drawn)
10M#2  TEST  [测试点（圆形）]  (value not drawn)
BITE1#2  红色  [LED0805]
BT1#2  电池座 小  [电池座 2032  直插]
C1#3  0.1uF  [0805]
C2#3  10uF  [1206]
C3#3  0.1uF  [0805]
C4#3  10uF  [1206]
C5#3  0.1uF  [0805]
C6#3  10uF  [1206]
C7#2  0.1uF  [0805]
C8#2  10uF  [1206]
C9#3  470u/35v  [电容 铝电解 470U/35V]
C10#3  0.1uF/50v  [0805]
C11#3  470u/35v  [电容 铝电解 470U/35V]
C12#3  104  [0805]
C13#3  10pF  [0805]
C14#2  0.1uF  [0805]
C15#2  10uF  [1206]
C18#3  0.1uF  [0805]
C19#3  0.1uF  [0805]
C20#3  20pF  [0805]
C21#3  10uF  [1206]
C22#3  10uF  [1206]
C23#3  100u/25V  [1206]
C24#3  0.1uF  [0805]
C25#3  100u/25V  [1206]
C26#3  0.1uF  [0805]
C27#3  0.1uF  [0805]
C28#3  0.1uF  [0805]
C29#2  0.1uF  [0805]
C30#3  0.1uF  [0805]
C31#3  0.1uF  [0805]
C32#3  0.1uF  [0805]
C33#3  0.1uF  [0805]
C34#3  0.1uF  [0805]
C35#2  0.1uF  [0805]
C36#2  0.1uF  [0805]
D1#3  1N5822  [二极管 贴片 4007]
D2#3  1N5822  [二极管 贴片 4007]
D3#2  1N5819  [二极管 贴片 IN4148]
D4#2  1N5819  [二极管 贴片 IN4148]
L1#3  100uH/3A  [电感 贴片 12*12]
L2#3  磁珠  [磁珠 直插]
L3#2  30V  3A  [30V/4A 自恢复保险]
L5#3  磁珠  [0805]
L6#2  磁珠  [0805]
L7#2  磁珠  [0805]
LED1#2  绿色  [LED0805]
LED2#3  红色  [Led0805]
LED3#3  红色  [LED0805]
P1#3  HT5.08-2  [KF128L-5.08-2P]
P2#3  SMA  [天线座 50ohm 直立]
P3#3  XH2.54-4  [VH2.54_4]
P4#3  XH2.54-10  [VH2.54_10]
P5#2  封装: DC3 2*5  [双排插针 2.54 2*5]  (hidden comment: DC3压线座)
P6#2  SMA  [天线座 50ohm 直立]
P7#2  SMA  [天线座 50ohm 直立]
R1#3  1K  [0805]
R2#3  30k  [0805]
R3#3  2K  [0805]
R4#3  10K  [0805]
R5#3  0  [0805]
R6#3  0  [0805]
R7#3  0  [0805]
R8#3  10R  [0805]
R9#3  510  [0805]
R10#3  1k  [0805]
R11#3  10R  [0805]
R12#3  510  [0805]
R13#3  10k  [0805]
R14#3  10k  [0805]
R15#2  1k  [0805]
R16#3  10k  [0805]
R17#3  10k  [0805]
R18#2  10k  [0805]
R19#2  1k  [0805]
R20#2  10  [0805]
R21#2  10  [0805]
R22#2  1k  [0805]
R23#2  0R  [0805]
R24#2  49.9  [0805]
R25#2  49.9  [0805]
R26  0R  [0805]
R27  0R  [0805]
R28  0R  [0805]
T1#2  TEST  [测试点（圆形）]  (value not drawn)
T3#2  TEST  [测试点（圆形）]  (value not drawn)
T4#2  TEST  [测试点（圆形）]  (value not drawn)
T5#2  TEST  [测试点（圆形）]  (value not drawn)
T6#2  TEST  [测试点（圆形）]  (value not drawn)
U1#3  SPX1117M3-3.3  [SOT223]
U2#3  LM2576T-ADJ  [TO220 LM2576-YA30]
U3#3  N303-3  [模块 N303-3]
U4#2  REF02  [SOIC8]
U5#3  EPM240T100C5N/570T100  [TQFP100]
U6#3  LMV321  [SOT23-5]
U7#3  LMV321  [SOT23-5]
U8#3  SA.53m(国产铷钟HXTF1031H)  [模块 SA.53m]
U9#3  NC7SZ125  [SOT23-5]
U10#2  NC7SZ125  [SOT23-5]
Y1#3  VCOCXO36-5V-10M  [模块 VCOCXO36-12V-10M]
Y2#3  VCTCXO-5V-10M  [模块 VCTCXO-5V-10M]

### Blocks framed on the sheet
GPS输出的1PPS，用于对齐计数沿: C13#3 R8#3

### Nets
5V: C1#3.2 C2#3.2 C11#3.1 C12#3.1 C25#3.1 C26#3.2 C27#3.1 C36#2.1 L1#3.2 L5#3.2 L6#2.2 R2#3.2 R3#3.1 U1#3.3(Vin) U9#3.5(VCC) U10#2.5(VCC)
12V: C7#2.2 C8#2.2 C9#3.1 C10#3.2 L2#3.2 U2#3.1(VIN) U4#2.2(VIN)
+3.3V: C3#3.2 C4#3.2 C5#3.2 C6#3.2 C28#3.2 C29#2.2 C30#3.2 C31#3.2 C32#3.2 C33#3.2 C34#3.2 C35#2.2 D3#2.1(A) P3#3.1 P5#2.4 R1#3.1 R16#3.2 R17#3.2 R18#2.2 R19#2.1 R22#2.2 R26.1 R28.2 U1#3.2(Vout) U1#3.4(Vout) U3#3.23(VCC) U5#3.9(VCCIO1) U5#3.13(VCCINT) U5#3.31(VCCIO1) U5#3.45(VCCIO1) U5#3.59(VCCIO2) U5#3.63(VCCINT) U5#3.80(VCCIO2) U5#3.94(VCCIO2)  [also labelled 3V3]
DC12V: D1#3.1(A) P1#3.2 P4#3.9 P4#3.10
GND: BT1#2.2(-) C1#3.1 C2#3.1 C3#3.1 C4#3.1 C5#3.1 C6#3.1 C7#2.1 C8#2.1 C9#3.2 C10#3.1 C11#3.2 C12#3.2 C13#3.1 C14#2.1 C15#2.1 C18#3.2 C19#3.2 C20#3.2 C21#3.1 C22#3.1 C23#3.2 C24#3.1 C25#3.2 C26#3.1 C27#3.2 C28#3.1 C29#2.1 C30#3.1 C31#3.1 C32#3.1 C33#3.1 C34#3.1 C35#2.1 C36#2.2 D2#3.1(A) L7#2.1 LED2#3.2(K) P1#3.1 P2#3.2 P3#3.4 P4#3.1 P4#3.2 P5#2.2 P5#2.10 P6#2.2 P7#2.2 R4#3.1 R10#3.1 R15#2.1 R23#2.1 R27.2 U1#3.1(GND) U2#3.3(GND) U2#3.5(~{ON}/OFF) U3#3.10(GND) U3#3.12(GND) U3#3.13(GND) U3#3.24(GND) U4#2.4(GND) U5#3.10(GNDIO) U5#3.11(GNDINT) U5#3.32(GNDIO) U5#3.46(GNDIO) U5#3.60(GNDIO) U5#3.65(GNDINT) U5#3.79(GNDIO) U5#3.93(GNDIO) U6#3.2(GND) U7#3.2(GND) U8#3.4(GND) U9#3.1(~{OE}) U9#3.3(GND) U10#2.1(~{OE}) U10#2.3(GND) Y1#3.5(GND) Y2#3.4(GND)
REF5V: C14#2.2 C15#2.2 C18#3.1 C19#3.1 U4#2.6(Vout) U6#3.5(VCC) U7#3.5(VCC)
VCC5V: C23#3.1 C24#3.2 L5#3.1 L6#2.1 U8#3.5(VCC) Y1#3.3(Power_Supply) Y2#3.2(VCC)
1PPS_OUT: 1PPS#2.1 P4#3.4 P7#2.1(Signal) R25#2.2
10M_OUT: C20#3.1 P4#3.6 R11#3.2 T4#2.1 U8#3.3(RF_OUTPUT) U9#3.2(A) Y1#3.4(RF.OUTPUT) Y2#3.3(RFout)  [also labelled Fre.OUTPUT]
40khz: 1#2.1 P4#3.5 R20#2.1
CLK_1: R21#2.2 U5#3.72(IO)
CLK_1K: U5#3.76(IO)
CLK_1M: U5#3.77(IO)
CLK_8: R20#2.2 U5#3.73(IO)
CLK_10: U5#3.74(IO)
CLK_10M: U5#3.78(IO)
CLK_100: U5#3.75(IO)
Fre.Control: T6#2.1 U6#3.3(IN-) U6#3.4(OUT) U8#3.1(Fre.Control) Y1#3.1(Control_Voltage/NC) Y2#3.1(Vcon/NC)
GPS_RX: P4#3.8 R5#3.1
GPS_TX: P4#3.7 R6#3.1
JTAG-TCK: P5#2.1 R15#2.2 U5#3.24(TCK)
JTAG-TDI: P5#2.9 R18#2.1 U5#3.23(TDI)
JTAG-TDO: P5#2.3 R16#3.1 U5#3.25(TDO)
JTAG-TMS: P5#2.5 R17#3.1 U5#3.22(TMS)
LOCK_LED: BITE1#2.2(K) U5#3.54(IO)
N303_1PPS: C13#3.2 LED1#2.2(K) R8#3.2 T1#2.1 U3#3.3(1PPS)
TOD_RX: U5#3.27(IO)
TOD_TX: P4#3.3 U5#3.26(IO)
Net7#2_1: 7#2.1 LED3#3.2(K) R21#2.1 U10#2.2(A)
Net10M#2_1: 10M#2.1 P6#2.1(Signal) R24#2.2
NetBITE1#2_1: BITE1#2.1(A) R22#2.1
NetBT1#2_1: BT1#2.1(+) D4#2.1(A)
NetC21#3_2: C21#3.2 R12#3.1 R13#3.2
NetC22#3_2: C22#3.2 R13#3.1 R14#3.2
NetD1#3_2: D1#3.2(K) L3#2.1
NetD2#3_2: D2#3.2(K) L1#3.1 U2#3.2(OUT)
NetD3#2_2: D3#2.2(K) D4#2.2(K) U3#3.22(V_BCKP)
NetL2#3_1: L2#3.1 L3#2.2
NetL7#2_2: L7#2.2 U8#3.2(CASE_GND)
NetLED1#2_1: LED1#2.1(A) R1#3.2
NetLED2#3_1: LED2#3.1(A) R3#3.2
NetLED3#3_1: LED3#3.1(A) R19#2.2
NetP2#3_1: P2#3.1(Signal) U3#3.11(RF_IN)
NetP3#3_2: P3#3.2 R5#3.2 U3#3.21(RX1)
NetP3#3_3: P3#3.3 R6#3.2 U3#3.20(TX1)
NetR2#3_1: R2#3.1 R4#3.2 U2#3.4(FB)
NetR7#3_1: R7#3.1 U3#3.8(V_ANT)
NetR7#3_2: R7#3.2 U3#3.9(VCC_RF)
NetR8#3_1: R8#3.1 U5#3.1(IO)
NetR9#3_1: R9#3.1 R10#3.2 U7#3.3(IN-)
NetR9#3_2: R9#3.2 T5#2.1 U6#3.1(IN+) U7#3.4(OUT)
NetR11#3_1: R11#3.1 U5#3.12(IO/GCLK0)
NetR12#3_2: R12#3.2 U7#3.1(IN+)
NetR14#3_1: R14#3.1 T3#2.1 U5#3.5(IO)
NetR23#2_2: R23#2.2 U5#3.90(IO/GNDINT)
NetR24#2_1: R24#2.1 U9#3.4(Y)
NetR25#2_1: R25#2.1 U10#2.4(Y)
NetR26_2: R26.2 U5#3.88(IO/VCCINT)
NetR27_1: R27.1 U5#3.37(IO/GNDINT)
NetR28_1: R28.1 U5#3.39(IO/VCCINT)

Not connected (* = marked no-connect by the designer): P5#2 6* 7* 8*; U3#3 1(nRESET) 2(NC)* 4(NC)* 5(NC)* 6(NC)* 7(NC)* 14(NC)* 15(NC)* 16(NC)* 17(PWR_DWN)* 18(TX2)* 19(RX2)*; U4#2 1(NIC)* 3(TENP)* 5(TRIM)* 7(NIC)* 8(NIC)*; U5#3 2(IO) 3(IO) 4(IO) 6(IO) 7(IO) 8(IO) 14(IO/GCLK1) 15(IO) 16(IO) 17(IO) 18(IO) 19(IO) 20(IO) 21(IO) 28(IO) 29(IO) 30(IO) 33(IO) 34(IO) 35(IO) 36(IO) 38(IO) 40(IO) 41(IO) 42(IO) 43(IO/DEV_OE) 44(IO) 47(IO/DEV_CLRn) 48(IO) 49(IO) 50(IO) 51(IO) 52(IO) 53(IO) 55(IO) 56(IO) 57(IO) 58(IO) 61(IO) 62(IO/GCLK2) 64(IO/GCLK3) 66(IO) 67(IO) 68(IO) 69(IO) 70(IO) 71(IO) 81(IO) 82(IO) 83(IO) 84(IO) 85(IO) 86(IO) 87(IO) 89(IO) 91(IO) 92(IO) 95(IO) 96(IO) 97(IO) 98(IO) 99(IO) 100(IO); U8#3 6(BITE)* 7(RS232-TX)* 8(RS232-RX)* J1-1(PPS-IN_1+)* J1-2(USB_DATA+)* J1-3(PPS-IN_1-)* J1-4(USB_DATA-)* J1-5(PPS-IN_0+)* J1-6(USB_POWER)* J1-7(PPS-IN_0-)* J1-8(GND)* J1-9(GND)* J1-10(NC)* J1-11(NC)* J1-12(NC)* J1-13(NC)* J1-14(NC)* J1-15(GND)* J1-16(NC)* J1-17(PPS-OUT_+)* J1-18(NC)* J1-19(PPS-OUT_-)* J1-20(ALARM)*; Y1#3 2(Refe.Voltage/NC)

### Notes on the sheet
- (near P1#3) DC12V
- (near T1#2) GPS_1PPS
- (near R7#3) 天线供电
- 电源
- (near P2#3) GPS_天线
- GPS
- 应先进行整形
- (near T3#2) 16b,152Hz
- 10M
- (near R23#2) 240不焊/570焊接
- PWM
- 40k输出用于本地RTC守时
- (near P5#2) JATG下载口
- 恒温晶振
- 温补晶振
- (near L7#2) 不焊
- (near R27) 240不焊/570焊接
- (near U8#3) 国产铷钟
- 10MHz
- CPLD
- (near R25#2) 1PPS
- 备注：V3.0从V2.0修改而来，问题及修改如下：
- 1、EPM240T100芯片容量不够，改为EPM570T100（37\39\88\90有差异）
- 2、PWM输出比较端供电采用高精度基准，保证电压精度
- 3、PWM滤波电容改为10uF与10K组合（频率150hz）
- Labels drawn without touching a wire or pin: 10M_OUT

### Library data of the parts
1#2 1PPS#2 7#2 10M#2 T1#2 T3#2 T4#2 T5#2 T6#2 = 测试点_小: 单位: 个; 名称: 测试点; 封装: 直插
BITE1#2 LED1#2 LED2#3 LED3#3 = 贴片发光二极管 0805: 封装: 0805; 单位: 个; 名称: 贴片发光二极管
C1#3 C3#3 C5#3 C7#2 C10#3 C13#3 C14#2 C18#3 C19#3 C20#3 C24#3 C26#3 C27#3 C28#3 C29#2 C30#3 C31#3 C32#3 C33#3 C34#3 C35#2 C36#2 = 电容 贴片 0805: 名称: 贴片电容; 单位: 个; 封装: 0805
C2#3 C4#3 C6#3 C8#2 C15#2 C21#3 C22#3 = 电容 贴片 0805: 名称: 贴片电容; 封装: 0805; 单位: 个
C9#3 = 电容 直插 电解  470u/35v: 名称: 电解电容; 封装: 直插; 单位: 个
C11#3 = 电解电容 470u/35v: 名称: 电解电容; 封装: 贴片; 单位: 个
C12#3 = 贴片电容 0805: 名称: 贴片电容; 单位: 个; 封装: 0805
C23#3 C25#3 = 电容 贴片 铝电解 470u/25V: 名称: 贴片铝电解电容; 封装: 贴片; 单位: 个
D1#3 D2#3 = 二极管 1N5822: 名称: 二极管; 封装: 直插; 单位: 个
D3#2 D4#2 = 二极管 贴片 1N4148: 名称: 贴片二极管; 封装: 贴片; 单位: 个
L1#3 = 电感 330uH/3A: 名称: 电感; 封装: 分立; 单位: 个
L2#3 = 磁珠: 封装: 0805; 单位: 个; 名称: 磁珠
L3#2 = 保险 自恢复: 单位: 个; 封装: 0805; 名称: 自恢复保险管
L5#3 L6#2 L7#2 = 磁珠: 单位: 个; 名称: 磁珠; 封装: 0805
P1#3 = 连接件 HT5.08-2: 名称: 连接件; 单位: 套; 封装: HT5.08-2
P2#3 P6#2 P7#2 = 连接件 天线座 SMA: 单位: 个; 封装: 直插; 名称: 联接件
P3#3 = 联结件 XH2.54-4: 名称: 联结件; 单位: 套; 封装: XH2.54-4
P4#3 = 连接件 XH2.54-10: 名称: 连接件; 单位: 套; 封装: XH2.54-10
P5#2 = 联结件 DC3 2*5: 名称: 联结件; 单位: 个
R1#3 R5#3 R6#3 R7#3 R8#3 R9#3 R10#3 R11#3 R12#3 R13#3 R14#3 R15#2 R16#3 R17#3 R18#2 R19#2 R20#2 R21#2 R22#2 R24#2 R25#2 = 电阻 贴片 0805: 名称: 贴片电阻; 单位: 个; 封装: 0805
R2#3 R3#3 R4#3 R23#2 R26-R28 = 贴片电阻 0805: 名称: 贴片电阻; 单位: 个; 封装: 0805
U1#3 = 贴片芯片 SPX1117M3-3.3: LDO; 名称: 贴片芯片; 单位: 个; 封装: SOT223
U2#3 = 贴片芯片 LM2575T-ADJ: 名称: 芯片; 封装: 直插; 单位: 个
U3#3 = 模块 N303-3: 单位: 个; 名称: 模块; 封装: 贴片
U4#2 = 贴片芯片 ADR02: 单位: 片; 名称: ADR02; 封装: SOIC8
U5#3 = EPM240T100C5N
U6#3 U7#3 = 贴片芯片 LMV321: 单位: 个; 名称: 芯片; 封装: SOT23-5
U8#3 = 模块 SA.53m: 封装: 直插; 单位: 个; 名称: 晶振
U9#3 U10#2 = 贴片芯片 NC7SZ125: 超高速缓冲; 单位: 个; 名称: 芯片; 封装: SOT23-5
Y1#3 = 模块 恒温VCOCXO36-12V 10M: 封装: 直插; 名称: 晶振; 单位: 个
Y2#3 = 模块 VCTCXO-5V-10M: 名称: 晶振; 单位: 个; 封装: 直插
BT1#2 = 电池座 小: Published: 24-Mar-1999; LatestRevisionDate: 17-Jul-2002; LatestRevisionNote: Re-released for DXP Platform.; PackageReference: BAT-2; Publisher: Altium Limited

## Nets that join several sheets
1.2V: FPGA (20 pins), POWER (C39.2 C40.2 U7#1.2 U7#1.4)
2.5V: FPGA (9 pins), POWER (C47.2 C48.2 U9#1.2 U9#1.4)
3.3V: FPGA (32 pins), POWER (5 pins)
5V: FPGA (5 pins), POWER (13 pins), GPSDO_V2.0 (16 pins), GPSDO_V3.0 (16 pins)
12V: POWER (5 pins), GPSDO_V2.0 (C9#2.1 C10#2.2 L2#2.2 U2#2.1), GPSDO_V3.0 (7 pins)
+3.3V: GPSDO_V2.0 (33 pins), GPSDO_V3.0 (34 pins)
DC12V: GPSDO_V2.0 (D1#2.1 P1#2.2 P4#2.9 P4#2.10), GPSDO_V3.0 (D1#3.1 P1#3.2 P4#3.9 P4#3.10)
GND: FPGA (62 pins), POWER (27 pins), GPSDO_V2.0 (70 pins), GPSDO_V3.0 (77 pins)
VCC5V: GPSDO_V2.0 (11 pins), GPSDO_V3.0 (7 pins)
1PPS_OUT: GPSDO_V2.0 (1PPS#1.1 P4#2.4 P7#1.1 R25#1.2), GPSDO_V3.0 (1PPS#2.1 P4#3.4 P7#2.1 R25#2.2)
10M_OUT: GPSDO_V2.0 (8 pins), GPSDO_V3.0 (8 pins)
40khz: GPSDO_V2.0 (1#1.1 P4#2.5 R20#1.1), GPSDO_V3.0 (1#2.1 P4#3.5 R20#2.1)
CLK_1: GPSDO_V2.0 (R21#1.2 U5#2.72), GPSDO_V3.0 (R21#2.2 U5#3.72)
CLK_1K: GPSDO_V2.0 (U5#2.76), GPSDO_V3.0 (U5#3.76)
CLK_1M: GPSDO_V2.0 (U5#2.77), GPSDO_V3.0 (U5#3.77)
CLK_8: GPSDO_V2.0 (R20#1.2 U5#2.73), GPSDO_V3.0 (R20#2.2 U5#3.73)
CLK_10: GPSDO_V2.0 (U5#2.74), GPSDO_V3.0 (U5#3.74)
CLK_10M: GPSDO_V2.0 (U5#2.78), GPSDO_V3.0 (U5#3.78)
CLK_100: GPSDO_V2.0 (U5#2.75), GPSDO_V3.0 (U5#3.75)
Fre.Control: GPSDO_V2.0 (6 pins), GPSDO_V3.0 (6 pins)
GPS_RX: GPSDO_V2.0 (P4#2.8 R5#2.1), GPSDO_V3.0 (P4#3.8 R5#3.1)
GPS_TX: GPSDO_V2.0 (P4#2.7 R6#2.1), GPSDO_V3.0 (P4#3.7 R6#3.1)
JTAG-TCK: GPSDO_V2.0 (P5#1.1 R15#1.2 U5#2.24), GPSDO_V3.0 (P5#2.1 R15#2.2 U5#3.24)
JTAG-TDI: GPSDO_V2.0 (P5#1.9 R18#1.1 U5#2.23), GPSDO_V3.0 (P5#2.9 R18#2.1 U5#3.23)
JTAG-TDO: GPSDO_V2.0 (P5#1.3 R16#2.1 U5#2.25), GPSDO_V3.0 (P5#2.3 R16#3.1 U5#3.25)
JTAG-TMS: GPSDO_V2.0 (P5#1.5 R17#2.1 U5#2.22), GPSDO_V3.0 (P5#2.5 R17#3.1 U5#3.22)
LOCK_LED: GPSDO_V2.0 (BITE1#1.2 U5#2.54), GPSDO_V3.0 (BITE1#2.2 U5#3.54)
N303_1PPS: GPSDO_V2.0 (5 pins), GPSDO_V3.0 (5 pins)
TOD_RX: GPSDO_V2.0 (U5#2.27), GPSDO_V3.0 (U5#3.27)
TOD_TX: GPSDO_V2.0 (P4#2.3 U5#2.26), GPSDO_V3.0 (P4#3.3 U5#3.26)